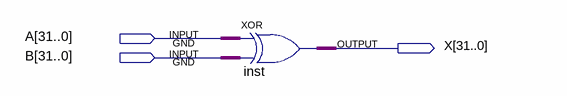
[diagram p0: schematic sheet]
// Quartus schematic xor32.bdf as structural Verilog: 1 symbols, 3 pins
module xor32 (
  input  [31:0] A,
  input  [31:0] B,
  output [31:0] X
);

  assign X = A ^ B;  // XOR inst, 32 bits wide
endmodule
